# Altium schematic sheet ESP32.SchDoc
size A; SheetNumber: 2; SheetTotal: 6
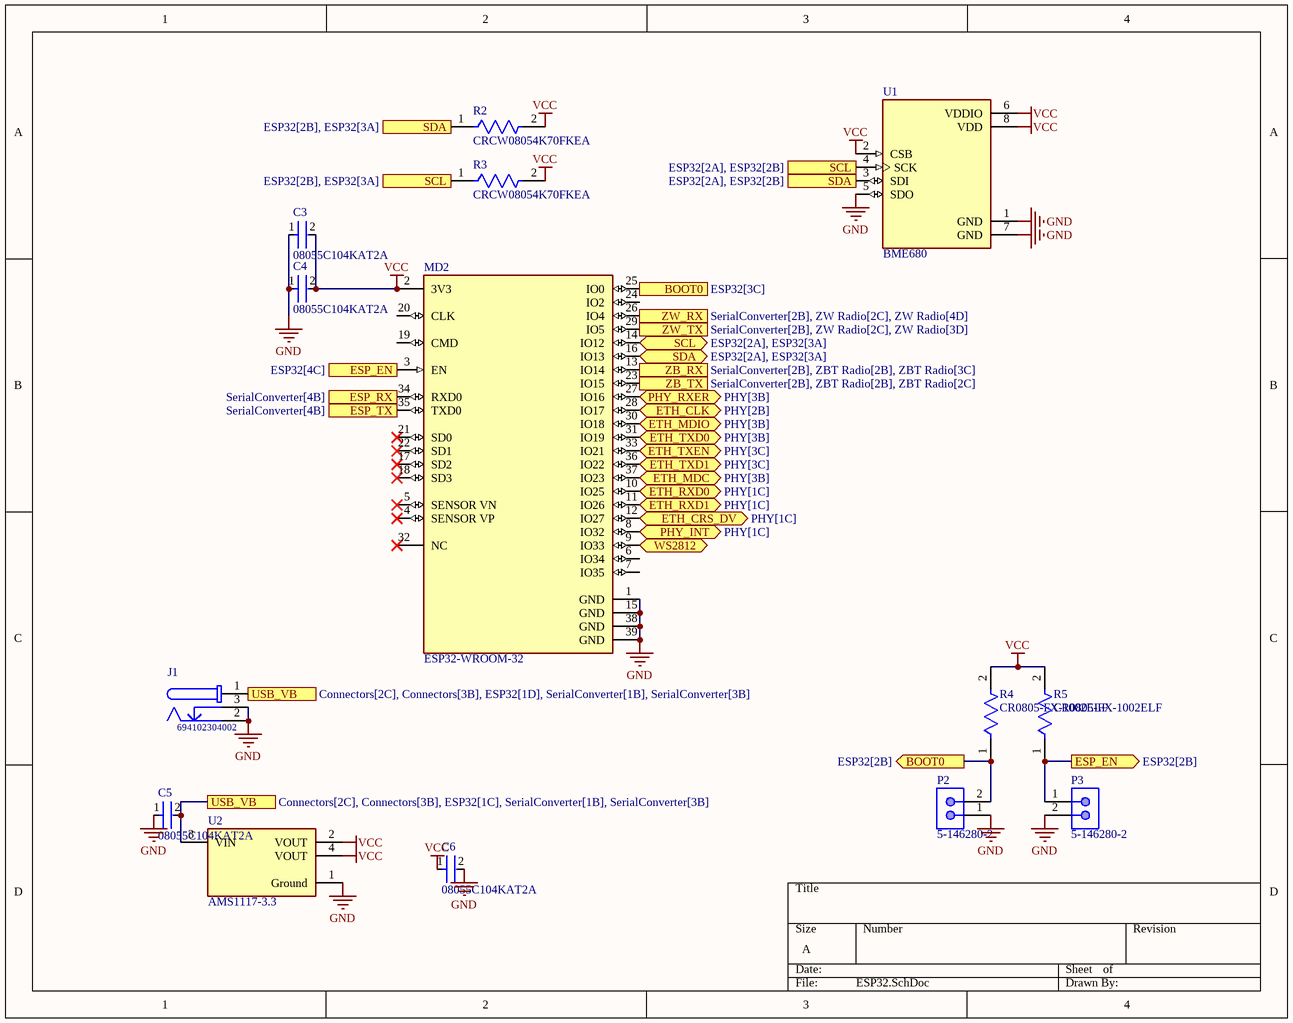
[diagram p0: ESP32.SchDoc]

## Parts
C3  08055C104KAT2A  [FP-0805-L_2_01_0_2-W_1_25-IPC_C]
C4  08055C104KAT2A  [FP-0805-L_2_01_0_2-W_1_25-IPC_C]
C5  08055C104KAT2A  [FP-0805-L_2_01_0_2-W_1_25-IPC_C]
C6  08055C104KAT2A  [FP-0805-L_2_01_0_2-W_1_25-IPC_C]
J1  694102304002  [694102304002]
MD2  ESP32-WROOM-32  [FP-ESP32-WROOM-32-MFG]
P2  5-146280-2  [TECO-5-146280-2_V]
P3  5-146280-2  [TECO-5-146280-2_V]
R2  CRCW08054K70FKEA  [FP-CRCW0805-e3-IPC_B]
R3  CRCW08054K70FKEA  [FP-CRCW0805-e3-IPC_B]
R4  CR0805-FX-1002ELF  [FP-CR0805-IPC_A]
R5  CR0805-FX-1002ELF  [FP-CR0805-IPC_A]
U1  BME680  [PSON80P300X300X100-8N]
U2  AMS1117-3.3  [FP-AMS1117-IPC_C]

## Ports
BOOT0 (in, see ESP32[3C]), BOOT0 (out, see ESP32[2B]), ESP_EN (in, see ESP32[4C]), ESP_EN (out, see ESP32[2B]), ESP_RX (in, see SerialConverter[4B]), ESP_TX (out, see SerialConverter[4B]), ETH_CLK (bidir, see PHY[2B]), ETH_CRS_DV (bidir, see PHY[1C]), ETH_MDC (bidir, see PHY[3B]), ETH_MDIO (bidir, see PHY[3B]), ETH_RXD0 (bidir, see PHY[1C]), ETH_RXD1 (bidir, see PHY[1C]), ETH_TXD0 (bidir, see PHY[3B]), ETH_TXD1 (bidir, see PHY[3C]), ETH_TXEN (bidir, see PHY[3C]), PHY_INT (bidir, see PHY[1C]), PHY_RXER (bidir, see PHY[3B]), SCL (bidir, see ESP32[2A], ESP32[3A]), SCL (see ESP32[2A], ESP32[2B]), SCL (see ESP32[2B], ESP32[3A]), SDA (bidir, see ESP32[2A], ESP32[3A]), SDA (see ESP32[2A], ESP32[2B]), SDA (see ESP32[2B], ESP32[3A]), USB_VB (see Connectors[2C], Connectors[3B], ESP32[1C], SerialConverter[1B], SerialConverter[3B]), USB_VB (see Connectors[2C], Connectors[3B], ESP32[1D], SerialConverter[1B], SerialConverter[3B]), WS2812 (bidir), ZB_RX (out, see SerialConverter[2B], ZBT Radio[2B], ZBT Radio[3C]), ZB_TX (in, see SerialConverter[2B], ZBT Radio[2B], ZBT Radio[2C]), ZW_RX (out, see SerialConverter[2B], ZW Radio[2C], ZW Radio[4D]), ZW_TX (in, see SerialConverter[2B], ZW Radio[2C], ZW Radio[3D])

## Nets
GND: C3.1 C4.1 C5.1 C6.2 J1.2 J1.3 MD2.1(GND) MD2.15(GND) MD2.38(GND) MD2.39(GND) P2.1 P3.2 U1.1(GND) U1.5(SDO) U1.7(GND) U2.1(Ground)
VCC: C3.2 C4.2 C6.1 MD2.2(3V3) R2.2 R3.2 R4.2 R5.2 U1.2(CSB) U1.6(VDDIO) U1.8(VDD) U2.2(VOUT) U2.4(VOUT)
BOOT0: MD2.25(IO0) P2.2 R4.1 ; port BOOT0
ESP_EN: MD2.3(EN) P3.1 R5.1 ; port ESP_EN
ESP_RX: MD2.34(RXD0) ; port ESP_RX
ESP_TX: MD2.35(TXD0) ; port ESP_TX
ETH_CLK: MD2.28(IO17) ; port ETH_CLK
ETH_CRS_DV: MD2.12(IO27) ; port ETH_CRS_DV
ETH_MDC: MD2.37(IO23) ; port ETH_MDC
ETH_MDIO: MD2.30(IO18) ; port ETH_MDIO
ETH_RXD0: MD2.10(IO25) ; port ETH_RXD0
ETH_RXD1: MD2.11(IO26) ; port ETH_RXD1
ETH_TXD0: MD2.31(IO19) ; port ETH_TXD0
ETH_TXD1: MD2.36(IO22) ; port ETH_TXD1
ETH_TXEN: MD2.33(IO21) ; port ETH_TXEN
PHY_INT: MD2.8(IO32) ; port PHY_INT
PHY_RXER: MD2.27(IO16) ; port PHY_RXER
SCL: MD2.14(IO12) R3.1 U1.4(SCK) ; port SCL
SDA: MD2.16(IO13) R2.1 U1.3(SDI) ; port SDA
USB_VB: C5.2 J1.1 U2.3(VIN) ; port USB_VB
WS2812: MD2.9(IO33) ; port WS2812
ZB_RX: MD2.13(IO14) ; port ZB_RX
ZB_TX: MD2.23(IO15) ; port ZB_TX
ZW_RX: MD2.26(IO4) ; port ZW_RX
ZW_TX: MD2.29(IO5) ; port ZW_TX

Not connected (* = marked no-connect by the designer): MD2 4(SENSOR_VP)* 5(SENSOR_VN)* 6(IO34) 7(IO35) 17(SD2)* 18(SD3)* 19(CMD) 20(CLK) 21(SD0)* 22(SD1)* 24(IO2) 32(NC)*

## Library data of the parts
C3-C6 = CMP-2000-05016-2: General Purpose Ceramic Capacitor, 0805, 100nF, 10%, X7R, 0.15, 50V; Dissipation Factor: 2.5%; Insulation Resistance: 100GR; Voltage Rating (DC): 50V; Package Quantity: 4000; Tolerance: 10%; Voltage Rating: 50V; Dielectric: X7R; Case/Package: 0805; Lead Free: Lead Free; Dielectric Material: Ceramic; Thickness: 0.037inch; Weight: 0.001411oz; Max Operating Temperature: 125°C; REACH SVHC: No SVHC; Mount: Surface Mount; RoHS Compliant: Yes; Depth: 1.25mm; Height: 0.5mm; Case Code (Metric): 2012; Length: 2mm; Termination: Standard; Case Code (Imperial): 0805; Number of Pins: 2; Voltage: 50V; Radiation Hardening: No; Min Operating Temperature: -55°C; Capacitance: 100nF; Width: 1.2mm; Series: MLCC X7R; Packaging: Cut Tape
J1 = CMP-1502-00184-1: DC Power Jack Connector Low Profile WR-DC, Male, Right Angled, THT, 2 A, 20 V; Manufacturer: Wurth Elektronik; Plug Outer Diameter: 3.5mm; Opening Diameter: 3.8mm; Plug Inner Diameter: 1.05mm; Rated Current: 2A; Working Voltage: 20V; Datasheet URL: http://katalog.we-online.de/em/datasheet/6941xx304002.pdf; Manufacturer URL: http://www.we-online.de; Publisher: WurthElektronik; Part Number: 694102304002; Package Reference: 694102304002; Packaging: Tray; Mounting Technology: THT; Operating Temperature: -40to85degC; Orientation: RightAngled; Gender: Male
MD2 = CMP-194065-000008-1: RX TXRX MOD WIFI SURFACE MOUNT; Frequency: 2.5GHz; Sensitivity: -98dBm; Operating Supply Voltage: 3.6V; Data Rate: 150Mbps; Weight: 0.088185oz; Package Quantity: 550; Min Operating Temperature: -40°C; Mount: Surface Mount; Max Operating Temperature: 85°C; Packaging: Cut Tape; Case/Package: SMD/SMT
P2 P3 = CMP-2000-07492-1: Male Header, Pitch 2.54 mm, 1 x 2 Position, Height 8.21 mm, Tail Length 3.05 mm, -65 to 105 degC, RoHS, Bulk; Manufacturer: TE Connectivity; Mating Connector Lock: No(Without); Number of Positions: 2; Pitch: 2.54mm; PCB Mounting Orientation: Vertical; Keyed: No; Case\/Package: 100; Mating Post Length: 0.23inch; High Temperature Housing: Yes; Max Current Rating: 5A; PCB Thickness: 0.063inch; PCB Mount Retention: Without; Approvals: CSA; Current Rating: 3A; Radiation Hardening: No; Length: 4.67mm; Contact Mating Length: 0.23inch; Connector Type: Header; Number of Rows: 1; Termination Post Length: 0.12inch; Board Standoff: No(Without); Max Operating Temperature: 105degC; Contact Shape: Square; Selectively Loaded: No(Without); Gasket: No(Without); Number of Contacts: 2; Contact Gender: Male; Mating Alignment: No(Without); Manufacturer URL: http://www.te.com/; Datasheet URL: http://www.te.com/commerce/DocumentDelivery/DDEController?Action=showdoc&DocId=Customer+Drawing%7F146280%7FH1%7Fpdf%7FEnglish%7FENG_CD_146280_H1.pdf%7F5-146280-2; Mount: ThroughHole; Orientation: Straight; Packaging: Carton; Package Reference: 5-146280-2; Package Quantity: 500; Stabilizers: No(Without); Row Spacing: 2.54mm; Contact Material: CopperAlloy; Panel Mount Retention: No(Without); Datasheet Version: Rev. H1, 08/2016; Housing Colour: Black; Colour: Black; Package Description: Male Header, Pitch 2.54 mm, 1 x 2 Position, Height 8.21 mm, Tail Length 3.05 mm; Contact Plating: Matte; Housing Material: Polymer; Contact Protection: No(Without); Min Operating Temperature: -65degC; Mounting Technology: ThroughHole; Flammability Rating: UL94V-0; RoHSCompliant: true; Termination: ThroughHole; Depth: 2.34mm; High Speed Serial Data Connector: No
R2 R3 = CMP-2100-03615-2: RES Thick Film, 4.7kΩ, 1%, 0.125W, 100ppm/°C, 0805; Max Power Dissipation: 125mW; Resistance: 4.7kR; Voltage Rating: 150V; Termination: SMD/SMT; Weight: 0.000194oz; Case/Package: 0805; Number of Terminations: 2; Min Operating Temperature: -55°C; Case Code (Metric): 2012; Package Quantity: 10; Depth: 1.25mm; Military Standard: Not; Composition: Thick Film; Radiation Hardening: No; Contact Plating: Tin; Height: 0.45mm; Power Rating: 125mW; Features: Automotive AEC-Q200; Tolerance: 1%; Packaging: Tape and Reel; Max Operating Temperature: 155°C; Length: 2mm; Case Code (Imperial): 0805; Voltage Rating (DC): 150V; Width: 1.25mm; Temperature Coefficient: 100ppm/°C; Lead Free: Lead Free
R4 R5 = CMP-07231-003204-1: Thick Film Chip Resistors 0805 10kΩ 0.125W 1% 100ppm/°C; Max Power Dissipation: 125mW; Voltage Rating: 150V; Voltage Rating (DC): 100V; Resistance: 10kR; Height: 0.5mm; Tolerance: 1%; Max Operating Temperature: 155°C; Thickness: 508um; Radiation Hardening: No; Packaging: Tape and Reel; Depth: 1.25mm; Contact Plating: Tin; Package Quantity: 1; Case Code (Metric): 2012; REACH SVHC: No SVHC; Min Operating Temperature: -55°C; Power Rating: 125mW; Mount: Surface Mount; Length: 2mm; Case Code (Imperial): 0805; Width: 1.25mm; Temperature Coefficient: 100ppm/°C; Termination: SMD/SMT; Composition: Thick Film; Features: Moisture Resistant; Case/Package: 0805; Number of Terminations: 2
U1 = BME680: Integrated Environmental Unit; MF: {'manufacturer': u'Bosch Sensortec'}; Package: None; Price: None; Value: *; MP: BME680; Availability: Unavailable
U2 = CMP-209535-000001-1: LDO Voltage Regulators 1A, 3.3V; Manufacturer: Advanced Monolithic Systems; Dropout Voltage: 1.1V; Output Type: Fixed; Nominal Supply Current: 5mA; Max Power Dissipation: 1.2W; Max Supply Voltage: 15V; Number Of Outputs: 1; Standoff Height: 0.64mm; Max Junction Temp: +125°C; Height: 1.8mm; Package: AMS1117; Device Class L2: Power Management ICs; ComponentLink2Description: Datasheet; ComponentLink2URL: http://www.advanced-monolithic.com/pdf/ds1117.pdf; Category: IC; RoHS: TRUE; Automotive: No; Device Class L1: Integrated Circuits (ICs); Output Current: 1A; Device Class L3: Voltage Regulators - Linear; Temperature: -40°C to +125°C; Output Voltage: 3.3V; Manufacturer Part Number: AMS1117-3.3; Temperature Range Low: -40°C; Octopart: https://octopart.com/ams1117-3.3-advanced+monolithic+systems-25899300; Lead Free: Yes; Ipc Land Pattern Name: SOT229P700X180-4; Temperature Range High: +125°C